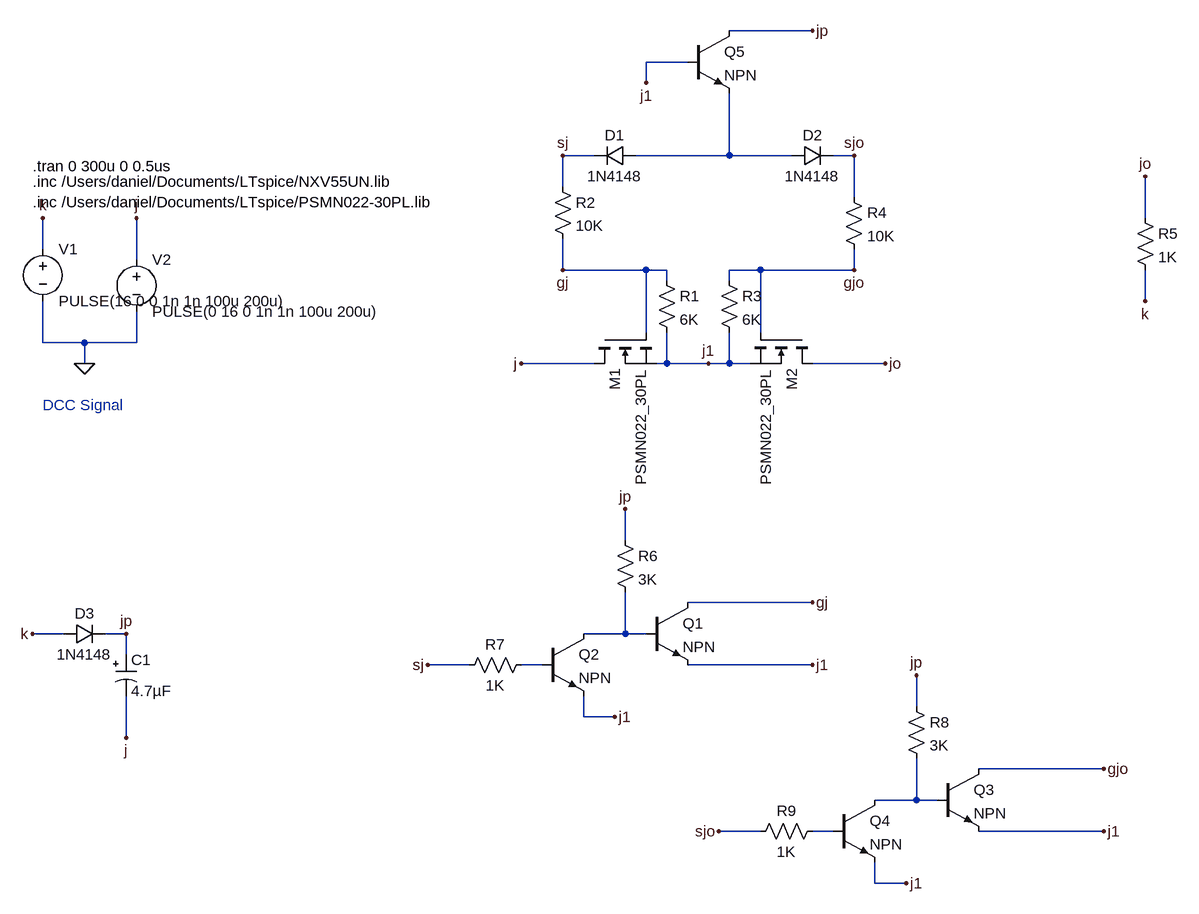
[diagram p0: schematic dccAbc3.asc]
dccAbc3.asc, the LTspice schematic file:
Version 4
SHEET 1 880 680
WIRE -672 -1024 -800 -1024
WIRE -864 -976 -928 -976
WIRE -928 -944 -928 -976
WIRE -1008 -832 -1056 -832
WIRE -800 -832 -800 -928
WIRE -800 -832 -944 -832
WIRE -704 -832 -800 -832
WIRE -608 -832 -640 -832
WIRE -1056 -784 -1056 -832
WIRE -608 -768 -608 -832
WIRE -160 -736 -160 -800
WIRE -1856 -688 -1856 -736
WIRE -1712 -672 -1712 -736
WIRE -1056 -656 -1056 -704
WIRE -928 -656 -1056 -656
WIRE -896 -656 -928 -656
WIRE -752 -656 -800 -656
WIRE -608 -656 -608 -688
WIRE -608 -656 -752 -656
WIRE -896 -640 -896 -656
WIRE -800 -640 -800 -656
WIRE -160 -608 -160 -656
WIRE -928 -560 -928 -656
WIRE -752 -560 -752 -656
WIRE -1856 -544 -1856 -608
WIRE -1792 -544 -1856 -544
WIRE -1712 -544 -1712 -592
WIRE -1712 -544 -1792 -544
WIRE -1792 -512 -1792 -544
WIRE -1008 -512 -1120 -512
WIRE -896 -512 -896 -560
WIRE -896 -512 -912 -512
WIRE -832 -512 -896 -512
WIRE -800 -512 -800 -560
WIRE -800 -512 -832 -512
WIRE -768 -512 -800 -512
WIRE -560 -512 -672 -512
WIRE -960 -240 -960 -288
WIRE -672 -144 -864 -144
WIRE -1824 -96 -1872 -96
WIRE -1728 -96 -1760 -96
WIRE -960 -96 -960 -160
WIRE -960 -96 -1024 -96
WIRE -928 -96 -960 -96
WIRE -1728 -64 -1728 -96
WIRE -1200 -48 -1264 -48
WIRE -1088 -48 -1120 -48
WIRE -672 -48 -864 -48
WIRE -512 16 -512 -32
WIRE -1024 32 -1024 0
WIRE -976 32 -1024 32
WIRE -1728 64 -1728 0
WIRE -224 112 -416 112
WIRE -512 160 -512 96
WIRE -512 160 -576 160
WIRE -480 160 -512 160
WIRE -752 208 -816 208
WIRE -640 208 -672 208
WIRE -224 208 -416 208
WIRE -576 288 -576 256
WIRE -528 288 -576 288
FLAG -1792 -512 0
FLAG -1856 -736 k
FLAG -1120 -512 j
FLAG -832 -512 j1
FLAG -560 -512 jo
FLAG -160 -800 jo
FLAG -160 -608 k
FLAG -1728 64 j
FLAG -1872 -96 k
FLAG -1728 -96 jp
FLAG -1712 -736 j
FLAG -1056 -656 gj
FLAG -608 -656 gjo
FLAG -1056 -832 sj
FLAG -608 -832 sjo
FLAG -672 -48 j1
FLAG -672 -144 gj
FLAG -976 32 j1
FLAG -1264 -48 sj
FLAG -960 -288 jp
FLAG -224 208 j1
FLAG -224 112 gjo
FLAG -528 288 j1
FLAG -816 208 sjo
FLAG -512 -32 jp
FLAG -672 -1024 jp
FLAG -928 -944 j1
SYMBOL voltage -1712 -688 R0
SYMATTR InstName V2
SYMATTR Value PULSE(0 16 0 1n 1n 100u 200u)
SYMBOL voltage -1856 -704 R0
SYMATTR InstName V1
SYMATTR Value PULSE(16 0 0 1n 1n 100u 200u)
SYMBOL nmos -1008 -560 M90
SYMATTR InstName M1
SYMATTR Value PSMN022_30PL
SYMATTR Prefix X
SYMBOL nmos -672 -560 R90
SYMATTR InstName M2
SYMATTR Value PSMN022_30PL
SYMATTR Prefix X
SYMBOL res -912 -656 R0
SYMATTR InstName R1
SYMATTR Value 6K
SYMBOL res -1072 -800 R0
SYMATTR InstName R2
SYMATTR Value 10K
SYMBOL res -816 -656 R0
SYMATTR InstName R3
SYMATTR Value 6K
SYMBOL res -624 -784 R0
SYMATTR InstName R4
SYMATTR Value 10K
SYMBOL diode -944 -848 R90
WINDOW 0 0 32 VBottom 2
WINDOW 3 32 32 VTop 2
SYMATTR InstName D1
SYMATTR Value 1N4148
SYMBOL diode -704 -848 M90
WINDOW 0 0 32 VBottom 2
WINDOW 3 32 32 VTop 2
SYMATTR InstName D2
SYMATTR Value 1N4148
SYMBOL res -176 -752 R0
SYMATTR InstName R5
SYMATTR Value 1K
SYMBOL diode -1824 -112 M90
WINDOW 0 0 32 VBottom 2
WINDOW 3 32 32 VTop 2
SYMATTR InstName D3
SYMATTR Value 1N4148
SYMBOL polcap -1744 -64 R0
SYMATTR InstName C1
SYMATTR Value 4.7µF
SYMBOL npn -928 -144 R0
SYMATTR InstName Q1
SYMBOL npn -1088 -96 R0
SYMATTR InstName Q2
SYMBOL res -976 -256 R0
SYMATTR InstName R6
SYMATTR Value 3K
SYMBOL res -1104 -64 R90
WINDOW 0 0 56 VBottom 2
WINDOW 3 32 56 VTop 2
SYMATTR InstName R7
SYMATTR Value 1K
SYMBOL npn -480 112 R0
SYMATTR InstName Q3
SYMBOL npn -640 160 R0
SYMATTR InstName Q4
SYMBOL res -528 0 R0
SYMATTR InstName R8
SYMATTR Value 3K
SYMBOL res -656 192 R90
WINDOW 0 0 56 VBottom 2
WINDOW 3 32 56 VTop 2
SYMATTR InstName R9
SYMATTR Value 1K
SYMBOL npn -864 -1024 R0
SYMATTR InstName Q5
TEXT -1872 -816 Left 2 !.tran 0 300u 0 0.5us
TEXT -1856 -448 Left 2 ;DCC Signal
TEXT -1872 -792 Left 2 !.inc /Users/daniel/Documents/LTspice/NXV55UN.lib\n.inc /Users/daniel/Documents/LTspice/PSMN022-30PL.lib

The netlist it stands for:
* dccAbc3.asc
V2 j 0 PULSE(0 16 0 1n 1n 100u 200u)
V1 k 0 PULSE(16 0 0 1n 1n 100u 200u)
XM1 j gj j1 PSMN022_30PL  ; pins D G S
XM2 jo gjo j1 PSMN022_30PL  ; pins D G S
R1 gj j1 6K
R2 sj gj 10K
R3 gjo j1 6K
R4 sjo gjo 10K
D1 N001 sj 1N4148
D2 N001 sjo 1N4148
R5 jo k 1K
D3 k jp 1N4148
C1 jp j 4.7µF
Q1 gj N002 j1 0 NPN
Q2 N002 N003 j1 0 NPN
R6 jp N002 3K
R7 N003 sj 1K
Q3 gjo N004 j1 0 NPN
Q4 N004 N005 j1 0 NPN
R8 jp N004 3K
R9 N005 sjo 1K
Q5 jp j1 N001 0 NPN
.model D D
.lib standard.dio
.model NPN NPN
.model PNP PNP
.lib standard.bjt
.tran 0 300u 0 0.5us
* DCC Signal
.inc /Users/daniel/Documents/LTspice/NXV55UN.lib
.inc /Users/daniel/Documents/LTspice/PSMN022-30PL.lib
.backanno
.end